# Altium schematic sheet NE555DWTZD.SchDoc
size A4
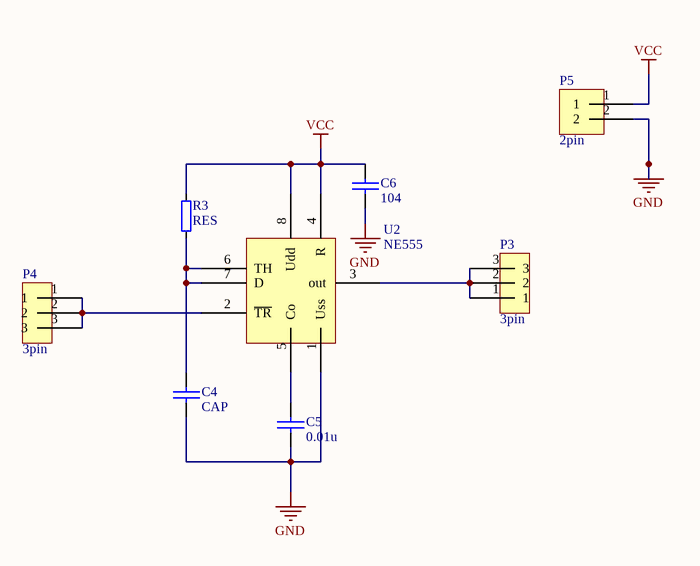
[diagram p0: NE555DWTZD.SchDoc]

## Parts
C4  CAP  [RAD0.1]
C5  0.01u  [RAD0.1]
C6  104  [RAD0.1]
P3  3pin  [3PIN排针]
P4  3pin  [3PIN排针]
P5  2pin  [2pin针]
R3  RES  [AXIAL0.4]
U2  NE555  [8pin座]

## Nets
GND: C4.2 C5.2 C6.2 P5.2 U2.1(Uss)
VCC: C6.1 P5.1 R3.2 U2.4(R) U2.8(Udd)
NetC4_1: C4.1 R3.1 U2.6(TH) U2.7(D)
NetC5_1: C5.1 U2.5(Co)
NetP3_1: P3.1 P3.2 P3.3 U2.3(out)
NetP4_1: P4.1 P4.2 P4.3 U2.2(~{TR})

## Library data of the parts
C5 C6 = CAP